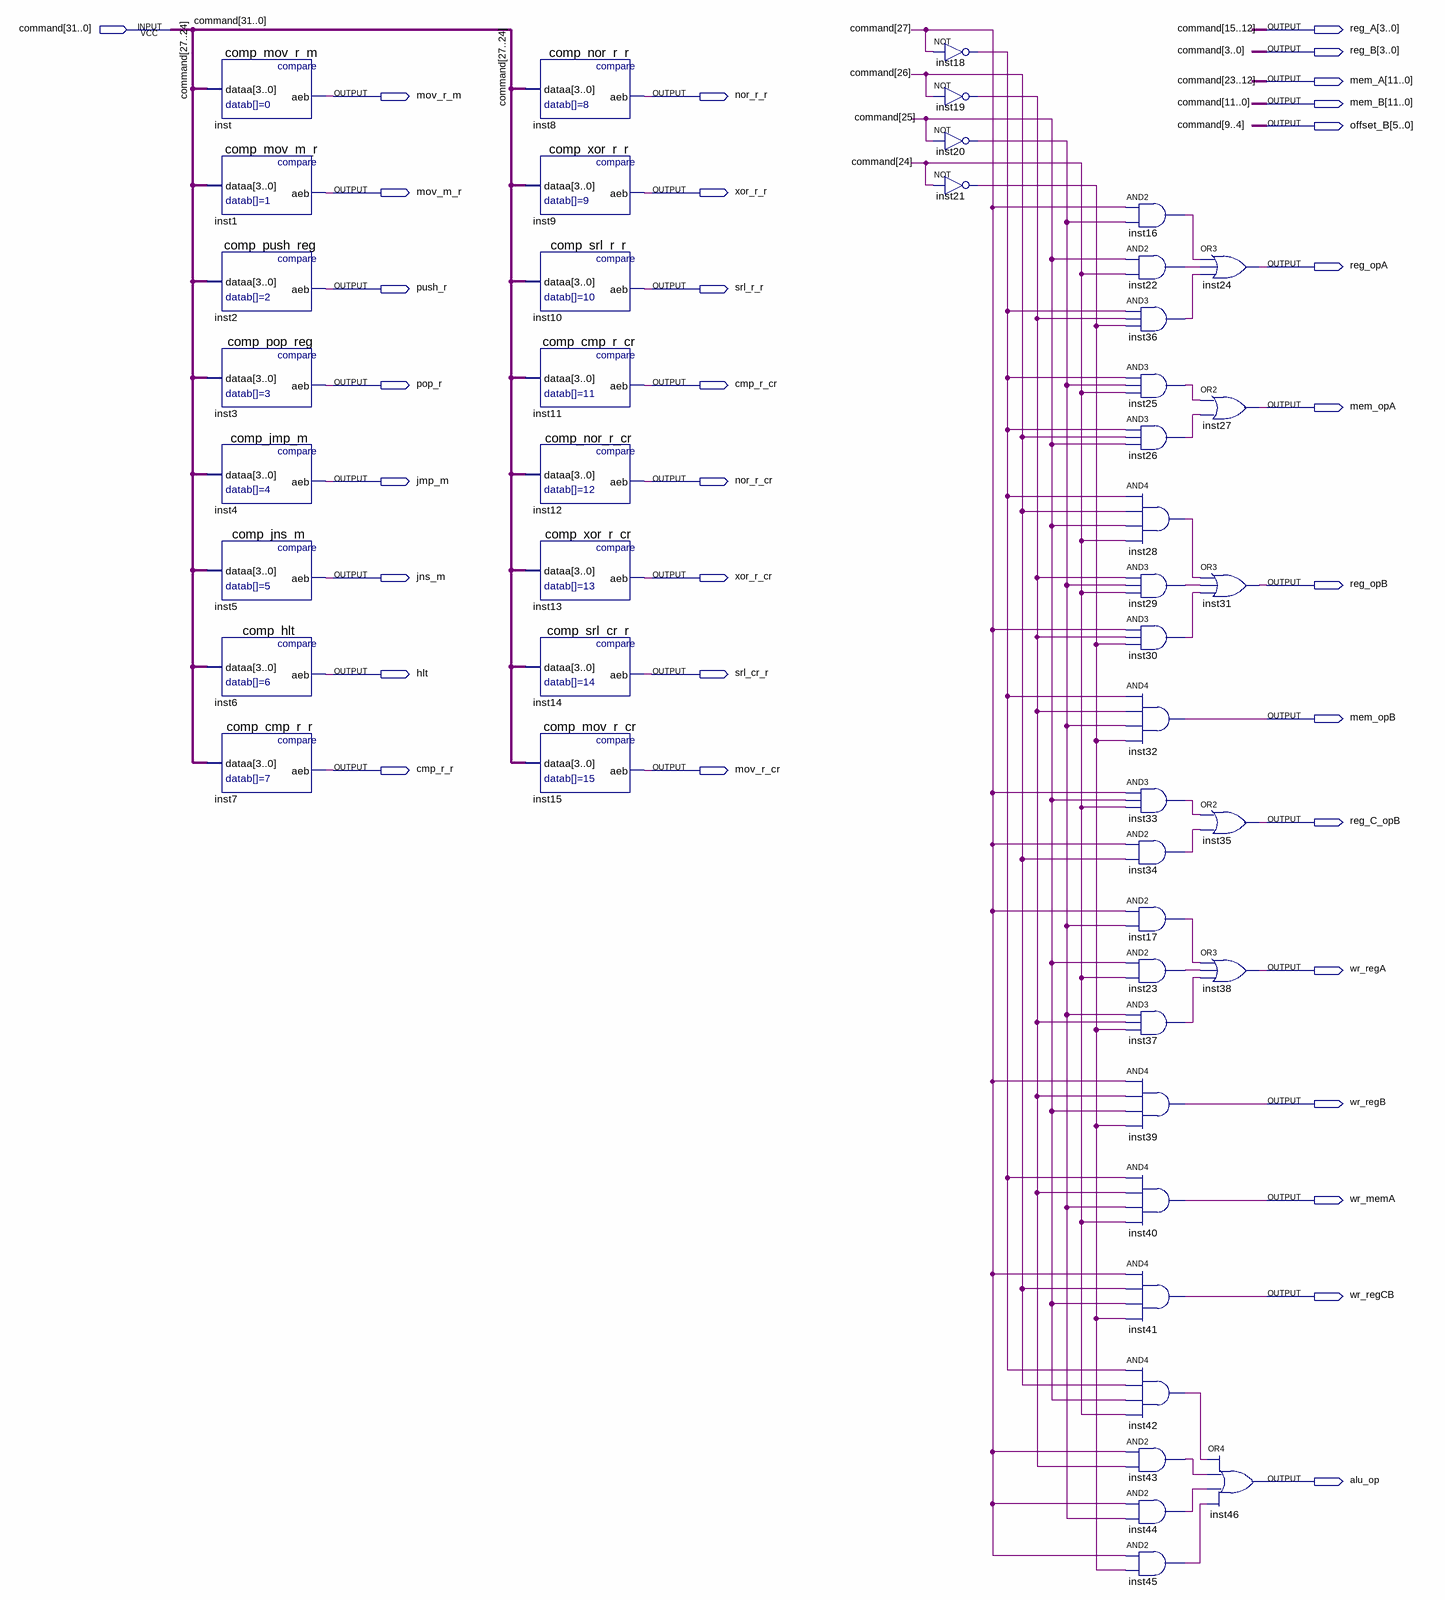
[diagram p0: schematic sheet]
// Quartus schematic DCD.bdf as structural Verilog: 47 symbols, 32 pins
module DCD (
  input  [31:0] command,
  output [3:0] reg_A,
  output [3:0] reg_B,
  output [11:0] mem_A,
  output mov_r_m,
  output nor_r_r,
  output [11:0] mem_B,
  output [5:0] offset_B,
  output mov_m_r,
  output xor_r_r,
  output reg_opA,
  output push_r,
  output srl_r_r,
  output pop_r,
  output cmp_r_cr,
  output mem_opA,
  output jmp_m,
  output nor_r_cr,
  output jns_m,
  output xor_r_cr,
  output reg_opB,
  output hlt,
  output srl_cr_r,
  output mem_opB,
  output cmp_r_r,
  output mov_r_cr,
  output reg_C_opB,
  output wr_regA,
  output wr_regB,
  output wr_memA,
  output wr_regCB,
  output alu_op
);

  wire inst16_out, inst17_out, inst18_out, inst19_out, inst20_out, inst21_out, inst22_out, inst23_out,
       inst25_out, inst26_out, inst28_out, inst29_out, inst30_out, inst33_out, inst34_out, inst36_out,
       inst37_out, inst42_out, inst43_out, inst44_out, inst45_out;

  comp_mov_r_m inst (.dataa(command[27:24]), .aeb(mov_r_m));
  comp_mov_m_r inst1 (.dataa(command[27:24]), .aeb(mov_m_r));
  comp_push_reg inst2 (.dataa(command[27:24]), .aeb(push_r));
  comp_pop_reg inst3 (.dataa(command[27:24]), .aeb(pop_r));
  comp_jmp_m inst4 (.dataa(command[27:24]), .aeb(jmp_m));
  comp_jns_m inst5 (.dataa(command[27:24]), .aeb(jns_m));
  comp_hlt inst6 (.dataa(command[27:24]), .aeb(hlt));
  comp_cmp_r_r inst7 (.dataa(command[27:24]), .aeb(cmp_r_r));
  comp_nor_r_r inst8 (.dataa(command[27:24]), .aeb(nor_r_r));
  comp_xor_r_r inst9 (.dataa(command[27:24]), .aeb(xor_r_r));
  comp_srl_r_r inst10 (.dataa(command[27:24]), .aeb(srl_r_r));
  comp_cmp_r_cr inst11 (.dataa(command[27:24]), .aeb(cmp_r_cr));
  comp_nor_r_cr inst12 (.dataa(command[27:24]), .aeb(nor_r_cr));
  comp_xor_r_cr inst13 (.dataa(command[27:24]), .aeb(xor_r_cr));
  comp_srl_cr_r inst14 (.dataa(command[27:24]), .aeb(srl_cr_r));
  comp_mov_r_cr inst15 (.dataa(command[27:24]), .aeb(mov_r_cr));
  not inst18 (inst18_out, command[27]);
  not inst19 (inst19_out, command[26]);
  not inst20 (inst20_out, command[25]);
  not inst21 (inst21_out, command[24]);
  and inst16 (inst16_out, command[27], inst20_out);
  and inst22 (inst22_out, command[25], command[24]);
  and inst36 (inst36_out, inst18_out, inst19_out, inst21_out);
  and inst25 (inst25_out, inst18_out, inst20_out, command[24]);
  and inst26 (inst26_out, inst18_out, command[26], command[25]);
  and inst28 (inst28_out, inst18_out, command[26], command[25], command[24]);
  and inst29 (inst29_out, inst19_out, inst20_out, command[24]);
  and inst30 (inst30_out, command[27], inst19_out, inst21_out);
  and inst32 (mem_opB, inst18_out, inst19_out, inst20_out, inst21_out);
  and inst33 (inst33_out, command[27], command[25], command[24]);
  and inst34 (inst34_out, command[27], command[26]);
  and inst17 (inst17_out, command[27], inst20_out);
  and inst23 (inst23_out, command[25], command[24]);
  and inst37 (inst37_out, inst20_out, inst19_out, inst21_out);
  and inst39 (wr_regB, command[27], inst19_out, command[25], inst21_out);
  and inst40 (wr_memA, inst18_out, inst19_out, inst20_out, command[24]);
  and inst41 (wr_regCB, command[27], command[26], command[25], inst21_out);
  and inst42 (inst42_out, inst18_out, command[26], command[25], command[24]);
  and inst43 (inst43_out, command[27], inst19_out);
  and inst44 (inst44_out, command[27], inst20_out);
  and inst45 (inst45_out, command[27], inst21_out);
  or inst24 (reg_opA, inst16_out, inst22_out, inst36_out);
  or inst27 (mem_opA, inst25_out, inst26_out);
  or inst31 (reg_opB, inst28_out, inst29_out, inst30_out);
  or inst35 (reg_C_opB, inst33_out, inst34_out);
  or inst38 (wr_regA, inst17_out, inst23_out, inst37_out);
  or inst46 (alu_op, inst42_out, inst43_out, inst44_out, inst45_out);

  assign mem_A = command[23:12];
  assign mem_B = command[11:0];
  assign offset_B = command[9:4];
  assign reg_A = command[15:12];
  assign reg_B = command[3:0];
endmodule
